# Altium project PCB_Driver.PrjPcb
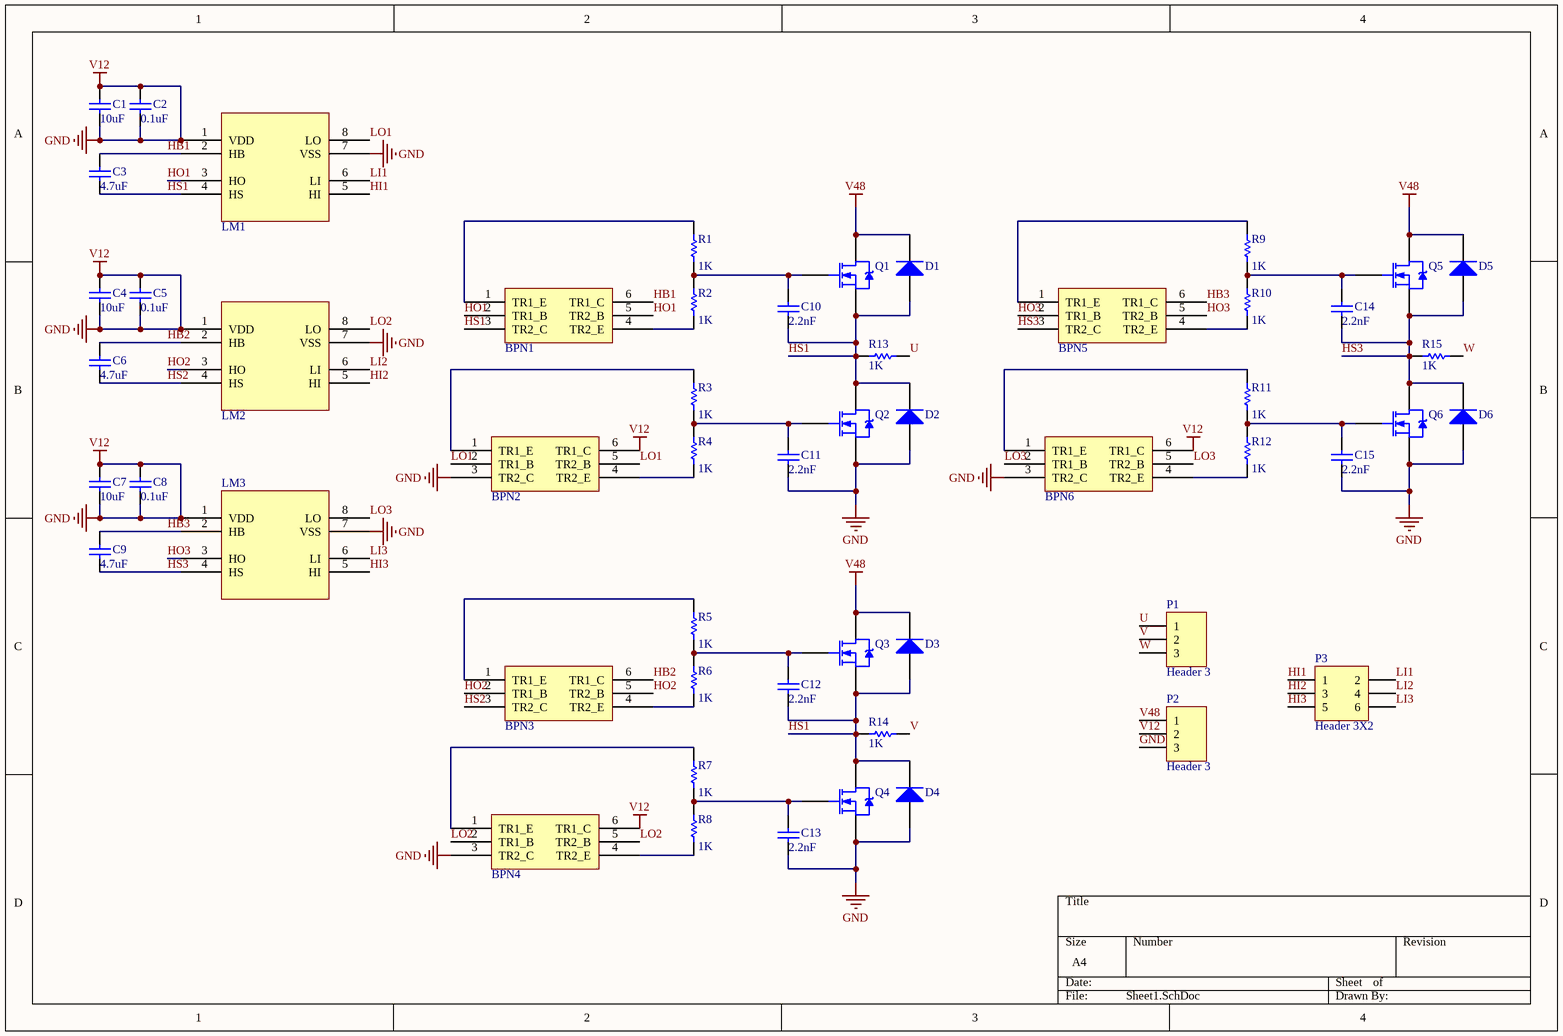
[diagram p0: Sheet1.SchDoc]
2 sheets, 81 parts. Net scope: global (net labels, ports and power ports of the same name join across sheets).
Board file: PCB1.PcbDoc
Sheets:
  Sheet1.SchDoc
  Sheet2.SchDoc

## Sheet Sheet1.SchDoc
size A4

### Parts
BPN1  BPN1  [BC847BPN]
BPN2  BPN2  [BC847BPN]
BPN3  BPN3  [BC847BPN]
BPN4  BPN4  [BC847BPN]
BPN5  BPN5  [BC847BPN]
BPN6  BPN6  [BC847BPN]
C1  value 10uF  [6-0805_M]  (hidden comment: Cap)
C2  value 0.1uF  [6-0805_M]  (hidden comment: Cap)
C3  value 4.7uF  [6-0805_M]  (hidden comment: Cap)
C4  value 10uF  [6-0805_M]  (hidden comment: Cap)
C5  value 0.1uF  [6-0805_M]  (hidden comment: Cap)
C6  value 4.7uF  [6-0805_M]  (hidden comment: Cap)
C7  value 10uF  [6-0805_M]  (hidden comment: Cap)
C8  value 0.1uF  [6-0805_M]  (hidden comment: Cap)
C9  value 4.7uF  [6-0805_M]  (hidden comment: Cap)
C10  value 2.2nF  [6-0805_M]  (hidden comment: Cap)
C11  value 2.2nF  [6-0805_M]  (hidden comment: Cap)
C12  value 2.2nF  [6-0805_M]  (hidden comment: Cap)
C13  value 2.2nF  [6-0805_M]  (hidden comment: Cap)
C14  value 2.2nF  [6-0805_M]  (hidden comment: Cap)
C15  value 2.2nF  [6-0805_M]  (hidden comment: Cap)
D1  Diode 1N914  [12Z-2010]  (value not drawn)
D2  Diode 1N914  [12Z-2010]  (value not drawn)
D3  Diode 1N914  [12Z-2010]  (value not drawn)
D4  Diode 1N914  [12Z-2010]  (value not drawn)
D5  Diode 1N914  [12Z-2010]  (value not drawn)
D6  Diode 1N914  [12Z-2010]  (value not drawn)
LM1  LM1  [LM5101A]
LM2  LM2  [LM5101A]
LM3  LM3  [LM5101A]  (value not drawn)
P1  Header 3  [HDR1X3]
P2  Header 3  [HDR1X3]
P3  Header 3X2  [HDR2X3]
Q1  NMOS-2  [SOT-23_M]  (value not drawn)
Q2  NMOS-2  [SOT23_M]  (value not drawn)
Q3  NMOS-2  [SOT-23_M]  (value not drawn)
Q4  NMOS-2  [SOT23_M]  (value not drawn)
Q5  NMOS-2  [SOT-23_M]  (value not drawn)
Q6  NMOS-2  [SOT23_M]  (value not drawn)
R1  value 1K  [6-0805_M]  (hidden comment: Res1)
R2  value 1K  [6-0805_M]  (hidden comment: Res1)
R3  value 1K  [6-0805_M]  (hidden comment: Res1)
R4  value 1K  [6-0805_M]  (hidden comment: Res1)
R5  value 1K  [6-0805_M]  (hidden comment: Res1)
R6  value 1K  [6-0805_M]  (hidden comment: Res1)
R7  value 1K  [6-0805_M]  (hidden comment: Res1)
R8  value 1K  [6-0805_M]  (hidden comment: Res1)
R9  value 1K  [6-0805_M]  (hidden comment: Res1)
R10  value 1K  [6-0805_M]  (hidden comment: Res1)
R11  value 1K  [6-0805_M]  (hidden comment: Res1)
R12  value 1K  [6-0805_M]  (hidden comment: Res1)
R13  value 1K  [6-0805_M]  (hidden comment: Res1)
R14  value 1K  [6-0805_M]  (hidden comment: Res1)
R15  value 1K  [6-0805_M]  (hidden comment: Res1)

### Nets
GND: BPN2.3(TR2_C) BPN2.6(TR1_C) BPN4.3(TR2_C) BPN4.6(TR1_C) BPN6.3(TR2_C) BPN6.6(TR1_C) C1.1 C1.2 C2.1 C2.2 C4.1 C4.2 C5.1 C5.2 C7.1 C7.2 C8.1 C8.2 C11.1 C13.1 C15.1 D2.1(A) D4.1(A) D6.1(A) LM1.1(VDD) LM1.7(VSS) LM2.1(VDD) LM2.7(VSS) LM3.1(VDD) LM3.7(VSS) P2.2 P2.3 Q2.3(S) Q4.3(S) Q6.3(S)  [also labelled V12]
V48: D1.2(K) D3.2(K) D5.2(K) P2.1 Q1.2(D) Q3.2(D) Q5.2(D)
HB1: BPN1.6(TR1_C) C3.2 LM1.2(HB)
HB2: BPN3.6(TR1_C) C6.2 LM2.2(HB)
HB3: BPN5.6(TR1_C) C9.2 LM3.2(HB)
HI1: LM1.5(HI) P3.1
HI2: LM2.5(HI) P3.3
HI3: LM3.5(HI) P3.5
HO1: BPN1.2(TR1_B) BPN1.5(TR2_B) LM1.3(HO)
HO2: BPN3.2(TR1_B) BPN3.5(TR2_B) LM2.3(HO)
HO3: BPN5.2(TR1_B) BPN5.5(TR2_B) LM3.3(HO)
HS1: BPN1.3(TR2_C) C3.1 C10.1 C12.1 D1.1(A) D2.2(K) D3.1(A) D4.2(K) LM1.4(HS) Q1.3(S) Q2.2(D) Q3.3(S) Q4.2(D) R13.2 R14.2
HS2: BPN3.3(TR2_C) C6.1 LM2.4(HS)
HS3: BPN5.3(TR2_C) C9.1 C14.1 D5.1(A) D6.2(K) LM3.4(HS) Q5.3(S) Q6.2(D) R15.2
LI1: LM1.6(LI) P3.2
LI2: LM2.6(LI) P3.4
LI3: LM3.6(LI) P3.6
LO1: BPN2.2(TR1_B) BPN2.5(TR2_B) LM1.8(LO)
LO2: BPN4.2(TR1_B) BPN4.5(TR2_B) LM2.8(LO)
LO3: BPN6.2(TR1_B) BPN6.5(TR2_B) LM3.8(LO)
U: P1.1 R13.1
V: P1.2 R14.1
W: P1.3 R15.1
NetBPN1_1: BPN1.1(TR1_E) R1.2
NetBPN1_4: BPN1.4(TR2_E) R2.1
NetBPN2_1: BPN2.1(TR1_E) R3.2
NetBPN2_4: BPN2.4(TR2_E) R4.1
NetBPN3_1: BPN3.1(TR1_E) R5.2
NetBPN3_4: BPN3.4(TR2_E) R6.1
NetBPN4_1: BPN4.1(TR1_E) R7.2
NetBPN4_4: BPN4.4(TR2_E) R8.1
NetBPN5_1: BPN5.1(TR1_E) R9.2
NetBPN5_4: BPN5.4(TR2_E) R10.1
NetBPN6_1: BPN6.1(TR1_E) R11.2
NetBPN6_4: BPN6.4(TR2_E) R12.1
NetC10_2: C10.2 Q1.1(G) R1.1 R2.2
NetC11_2: C11.2 Q2.1(G) R3.1 R4.2
NetC12_2: C12.2 Q3.1(G) R5.1 R6.2
NetC13_2: C13.2 Q4.1(G) R7.1 R8.2
NetC14_2: C14.2 Q5.1(G) R9.1 R10.2
NetC15_2: C15.2 Q6.1(G) R11.1 R12.2

### Library data of the parts
BPN1-BPN6 = BC847BPN
C1-C15 = Cap: Capacitor; Published: 8-Jun-2000; LatestRevisionDate: 17-Jul-2002; LatestRevisionNote: Re-released for DXP Platform.; PackageReference: RAD-0.3; Publisher: Altium Limited; PackageDescription: Radial Cap, Thru-Hole; 2 Leads; 0.3 in Pin Spacing
D1-D6 = Diode 1N914: High Conductance Fast Diode; Published: 8-Jun-2000; LatestRevisionDate: 17-Jul-2002; LatestRevisionNote: Re-released for DXP Platform.; DatasheetVersion: 1997; PackageReference: DO-35; Publisher: Altium Limited; PackageDescription: Diode, Axial; Body 3.8 x 1.9 mm (LxDia. max), Lead Dia. 0.53 mm (max); Code_JEDEC: DO-204-AH; ComponentLink1Description: Manufacturer Link; ComponentLink1URL: http://www.fairchildsemi.com/; ComponentLink2Description: Datasheet; ComponentLink2URL: http://www.fairchildsemi.com/ds/1N%2F1N4448.pdf
LM1-LM3 = LM5101A
P1 P2 = Header 3: Header, 3-Pin; LatestRevisionDate: 17-Jul-2002; LatestRevisionNote: Re-released for DXP Platform.; Publisher: Altium Limited
P3 = Header 3X2: Header, 3-Pin, Dual row; LatestRevisionDate: 17-Jul-2002; LatestRevisionNote: Re-released for DXP Platform.; Publisher: Altium Limited
Q1-Q6 = NMOS-2: N-Channel Power MOSFET; Note: Pin 2 is electrically connected to pin 4.; Published: 8-Jun-2000; LatestRevisionDate: 17-Jul-2002; LatestRevisionNote: Re-released for DXP Platform.; DatasheetVersion: PD-9.814; PackageVersion: Feb-1997; PackageReference: TO-220AB; Publisher: Altium Limited; PackageDescription: TO, Thru-Hole, Vertical, Heatsink Mounted; 3 In-Line Leads; Pitch 2.54 mm; ComponentLink1Description: Manufacturer Link; ComponentLink1URL: http://www.irf.com/
R1-R15 = Res1: Resistor; Published: 8-Jun-2000; LatestRevisionDate: 17-Jul-2002; LatestRevisionNote: Re-released for DXP Platform.; PackageReference: AXIAL-0.3; Publisher: Altium Limited; PackageDescription: Axial Device, Thru-Hole; 2 Leads; 0.3 in Pin Spacing

## Sheet Sheet2.SchDoc
size A4
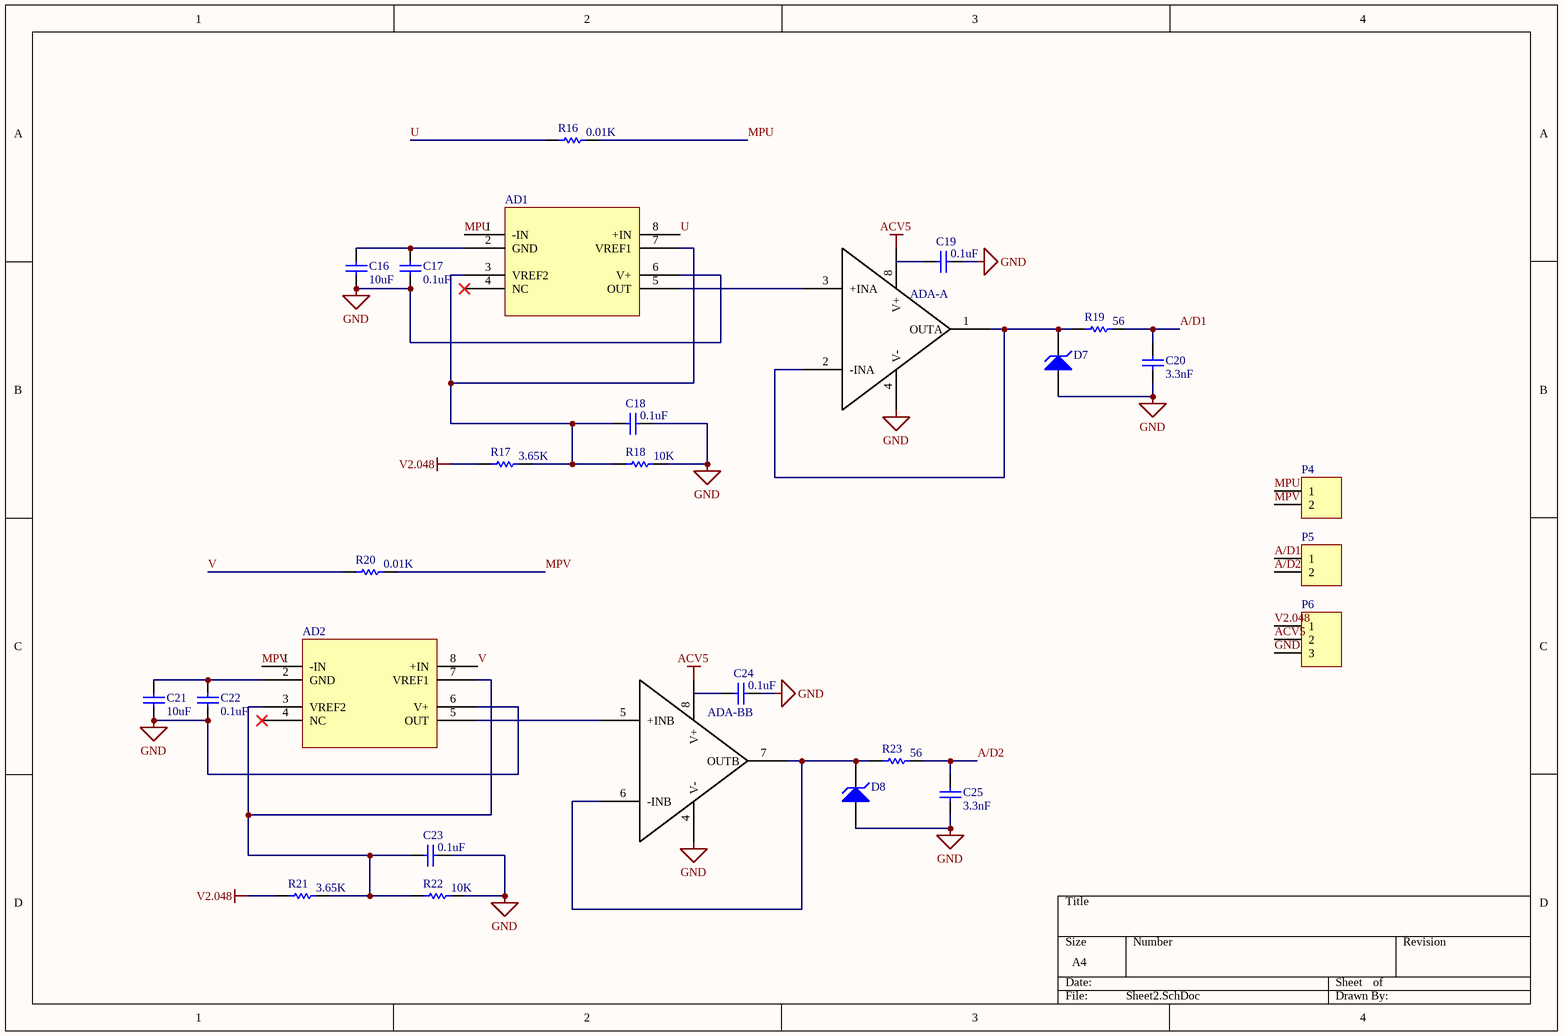
[diagram p1: Sheet2.SchDoc]

### Parts
AD1  AD8210  [AD8210]  (value not drawn)
AD2  AD8210  [AD8210]  (value not drawn)
ADA-  Component_1  [ADA4096]  (value not drawn)  (part A of 2)
ADA-B  ADA-B  [ADA4096]  (value not drawn)  (part B of 2)
C16  value 10uF  [6-0805_M]  (hidden comment: Cap)
C17  value 0.1uF  [6-0805_M]  (hidden comment: Cap)
C18  value 0.1uF  [6-0805_M]  (hidden comment: Cap)
C19  value 0.1uF  [6-0805_M]  (hidden comment: Cap)
C20  value 3.3nF  [6-0805_M]  (hidden comment: Cap)
C21  value 10uF  [6-0805_M]  (hidden comment: Cap)
C22  value 0.1uF  [6-0805_M]  (hidden comment: Cap)
C23  value 0.1uF  [6-0805_M]  (hidden comment: Cap)
C24  value 0.1uF  [6-0805_M]  (hidden comment: Cap)
C25  value 3.3nF  [6-0805_M]  (hidden comment: Cap)
D7  D Zener  [12Z-2010]  (value not drawn)
D8  D Zener  [12Z-2010]  (value not drawn)
P4  Header 2  [HDR1X2]  (value not drawn)
P5  Header 2  [HDR1X2]  (value not drawn)
P6  Header 3  [HDR1X3]  (value not drawn)
R16  value 0.01K  [6-0805_M]  (hidden comment: Res1)
R17  value 3.65K  [6-0805_M]  (hidden comment: Res1)
R18  value 10K  [6-0805_M]  (hidden comment: Res1)
R19  value 56  [6-0805_M]  (hidden comment: Res1)
R20  value 0.01K  [6-0805_M]  (hidden comment: Res1)
R21  value 3.65K  [6-0805_M]  (hidden comment: Res1)
R22  value 10K  [6-0805_M]  (hidden comment: Res1)
R23  value 56  [6-0805_M]  (hidden comment: Res1)

### Nets
ACV5: ADA-.8(V+) ADA-B.8(V+) P6.2
GND: AD1.6(V+) AD2.6(V+) ADA-.4(V-) ADA-B.4(V-) C16.1 C17.1 C18.2 C19.2 C20.1 C21.1 C22.1 C23.2 C24.2 C25.1 D7.1(A) D8.1(A) P6.3 R18.2 R22.2
V2.048: P6.1 R17.1 R21.1
A/D1: C20.2 P5.1 R19.2
A/D2: C25.2 P5.2 R23.2
MPU: AD1.1(-IN) P4.1 R16.2
MPV: AD2.1(-IN) P4.2 R20.2
U: AD1.8(+IN) R16.1
V: AD2.8(+IN) R20.1
NetAD1_2: AD1.2(GND) C16.2 C17.2
NetAD1_3: AD1.3(VREF2) AD1.7(VREF1) C18.1 R17.2 R18.1
NetAD1_5: AD1.5(OUT) ADA-.3(+INA)
NetAD2_2: AD2.2(GND) C21.2 C22.2
NetAD2_3: AD2.3(VREF2) AD2.7(VREF1) C23.1 R21.2 R22.1
NetAD2_5: AD2.5(OUT) ADA-B.5(+INB)
NetADA-_1: ADA-.1(OUTA) ADA-.2(-INA) D7.2(K) R19.1
NetADA-B_6: ADA-B.6(-INB) ADA-B.7(OUTB) D8.2(K) R23.1

Not connected (* = marked no-connect by the designer): AD1 4(NC)*; AD2 4(NC)*; C19 1; C24 1

### Library data of the parts
AD1 AD2 ADA-B = Component_1
C16-C25 = Cap: Capacitor; Published: 8-Jun-2000; LatestRevisionDate: 17-Jul-2002; LatestRevisionNote: Re-released for DXP Platform.; PackageReference: RAD-0.3; Publisher: Altium Limited; PackageDescription: Radial Cap, Thru-Hole; 2 Leads; 0.3 in Pin Spacing
D7 D8 = D Zener: Zener Diode; Published: 8-Jun-2000; LatestRevisionDate: 17-Jul-2002; LatestRevisionNote: Re-released for DXP Platform.; PackageReference: DIODE-0.7; Publisher: Altium Limited; PackageDescription: Diode, Thru-Hole; 2 Leads; 0.7 in Pin Spacing
P4 P5 = Header 2: Header, 2-Pin; LatestRevisionDate: 17-Jul-2002; LatestRevisionNote: Re-released for DXP Platform.; Publisher: Altium Limited
P6 = Header 3: Header, 3-Pin; LatestRevisionDate: 17-Jul-2002; LatestRevisionNote: Re-released for DXP Platform.; Publisher: Altium Limited
R16-R23 = Res1: Resistor; Published: 8-Jun-2000; LatestRevisionDate: 17-Jul-2002; LatestRevisionNote: Re-released for DXP Platform.; PackageReference: AXIAL-0.3; Publisher: Altium Limited; PackageDescription: Axial Device, Thru-Hole; 2 Leads; 0.3 in Pin Spacing

## Nets that join several sheets
GND: Sheet1 (35 pins), Sheet2 (19 pins)
U: Sheet1 (P1.1 R13.1), Sheet2 (AD1.8 R16.1)
V: Sheet1 (P1.2 R14.1), Sheet2 (AD2.8 R20.1)